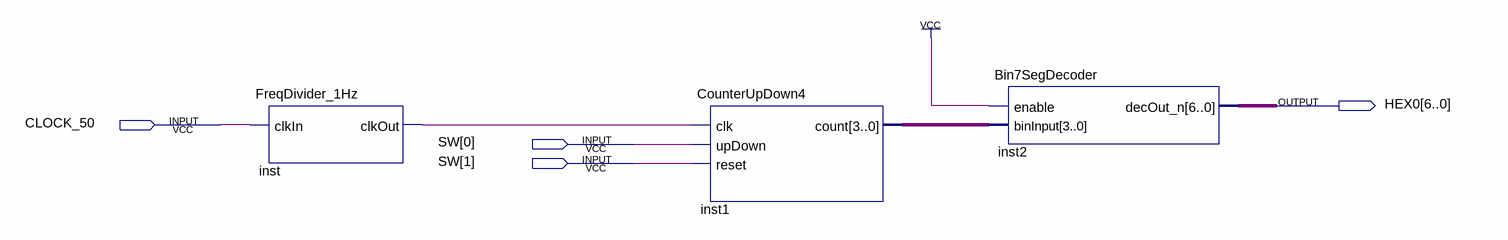
[diagram p0: schematic sheet]
// Quartus schematic CounterByFreq.bdf as structural Verilog: 3 symbols, 4 pins
module CounterByFreq (
  input  CLOCK_50,
  input  [1:0] SW,
  output [6:0] HEX0
);

  wire inst_clkout;
  wire [3:0] inst1_count;

  FreqDivider_1Hz inst (.clkIn(CLOCK_50), .clkOut(inst_clkout));
  CounterUpDown4 inst1 (.clk(inst_clkout), .upDown(SW[0]), .reset(SW[1]), .count(inst1_count));
  Bin7SegDecoder inst2 (.enable(1'b1), .binInput(inst1_count), .decOut_n(HEX0));
endmodule
